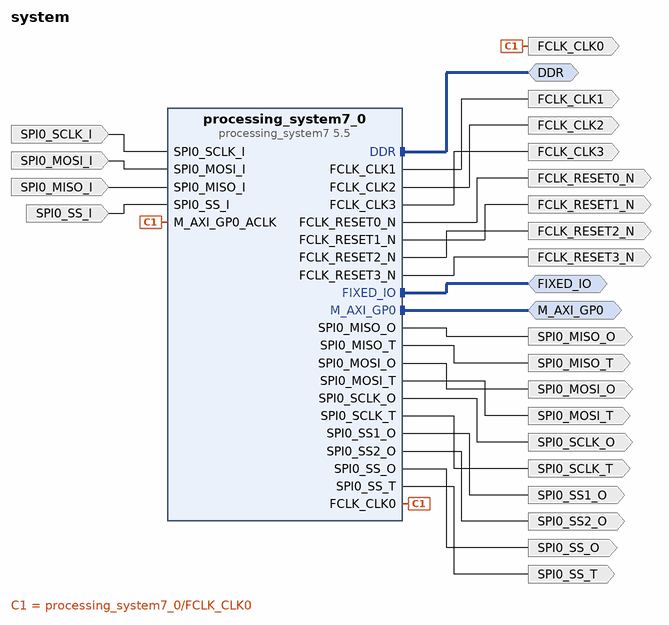
[diagram p0: block diagram of the top level]
# Vivado block design system, xc7z010clg400-1, Vivado 2016.4
create_bd_design system

create_bd_intf_port -mode Master -vlnv xilinx.com:interface:ddrx_rtl:1.0 DDR
create_bd_intf_port -mode Master -vlnv xilinx.com:display_processing_system7:fixedio_rtl:1.0 FIXED_IO
create_bd_intf_port -mode Master -vlnv xilinx.com:interface:aximm_rtl:1.0 M_AXI_GP0
set_property -dict {CONFIG.DATA_WIDTH 32 CONFIG.PROTOCOL AXI3 CONFIG.ADDR_WIDTH 32} [get_bd_intf_ports M_AXI_GP0]
create_bd_port -dir O -type clk FCLK_CLK0
set_property -dict {CONFIG.ASSOCIATED_BUSIF M_AXI_GP0} [get_bd_ports FCLK_CLK0]
create_bd_port -dir O -type clk FCLK_CLK1
create_bd_port -dir O -type clk FCLK_CLK2
create_bd_port -dir O -type clk FCLK_CLK3
create_bd_port -dir O -type rst FCLK_RESET0_N
create_bd_port -dir O -type rst FCLK_RESET1_N
create_bd_port -dir O -type rst FCLK_RESET2_N
create_bd_port -dir O -type rst FCLK_RESET3_N
create_bd_port -dir I SPI0_SCLK_I
create_bd_port -dir O SPI0_SCLK_O
create_bd_port -dir O SPI0_SCLK_T
create_bd_port -dir I SPI0_MOSI_I
create_bd_port -dir O SPI0_MOSI_O
create_bd_port -dir O SPI0_MOSI_T
create_bd_port -dir I SPI0_MISO_I
create_bd_port -dir O SPI0_MISO_O
create_bd_port -dir O SPI0_MISO_T
create_bd_port -dir I SPI0_SS_I
create_bd_port -dir O SPI0_SS_O
create_bd_port -dir O SPI0_SS1_O
create_bd_port -dir O SPI0_SS2_O
create_bd_port -dir O SPI0_SS_T

create_bd_cell -type ip -vlnv xilinx.com:ip:processing_system7:5.5 processing_system7_0

# ---- connections ----

connect_bd_intf_net [get_bd_intf_ports DDR] [get_bd_intf_pins processing_system7_0/DDR]
connect_bd_intf_net [get_bd_intf_ports FIXED_IO] [get_bd_intf_pins processing_system7_0/FIXED_IO]
connect_bd_intf_net [get_bd_intf_ports M_AXI_GP0] [get_bd_intf_pins processing_system7_0/M_AXI_GP0]
connect_bd_net [get_bd_pins processing_system7_0/FCLK_CLK0] [get_bd_ports FCLK_CLK0] [get_bd_pins processing_system7_0/M_AXI_GP0_ACLK]
connect_bd_net [get_bd_pins processing_system7_0/FCLK_CLK1] [get_bd_ports FCLK_CLK1]
connect_bd_net [get_bd_pins processing_system7_0/FCLK_CLK2] [get_bd_ports FCLK_CLK2]
connect_bd_net [get_bd_pins processing_system7_0/FCLK_CLK3] [get_bd_ports FCLK_CLK3]
connect_bd_net [get_bd_pins processing_system7_0/FCLK_RESET0_N] [get_bd_ports FCLK_RESET0_N]
connect_bd_net [get_bd_pins processing_system7_0/FCLK_RESET1_N] [get_bd_ports FCLK_RESET1_N]
connect_bd_net [get_bd_pins processing_system7_0/FCLK_RESET2_N] [get_bd_ports FCLK_RESET2_N]
connect_bd_net [get_bd_pins processing_system7_0/FCLK_RESET3_N] [get_bd_ports FCLK_RESET3_N]
connect_bd_net [get_bd_ports SPI0_SCLK_I] [get_bd_pins processing_system7_0/SPI0_SCLK_I]
connect_bd_net [get_bd_pins processing_system7_0/SPI0_SCLK_O] [get_bd_ports SPI0_SCLK_O]
connect_bd_net [get_bd_pins processing_system7_0/SPI0_SCLK_T] [get_bd_ports SPI0_SCLK_T]
connect_bd_net [get_bd_ports SPI0_MOSI_I] [get_bd_pins processing_system7_0/SPI0_MOSI_I]
connect_bd_net [get_bd_pins processing_system7_0/SPI0_MOSI_O] [get_bd_ports SPI0_MOSI_O]
connect_bd_net [get_bd_pins processing_system7_0/SPI0_MOSI_T] [get_bd_ports SPI0_MOSI_T]
connect_bd_net [get_bd_ports SPI0_MISO_I] [get_bd_pins processing_system7_0/SPI0_MISO_I]
connect_bd_net [get_bd_pins processing_system7_0/SPI0_MISO_O] [get_bd_ports SPI0_MISO_O]
connect_bd_net [get_bd_pins processing_system7_0/SPI0_MISO_T] [get_bd_ports SPI0_MISO_T]
connect_bd_net [get_bd_ports SPI0_SS_I] [get_bd_pins processing_system7_0/SPI0_SS_I]
connect_bd_net [get_bd_pins processing_system7_0/SPI0_SS_O] [get_bd_ports SPI0_SS_O]
connect_bd_net [get_bd_pins processing_system7_0/SPI0_SS1_O] [get_bd_ports SPI0_SS1_O]
connect_bd_net [get_bd_pins processing_system7_0/SPI0_SS2_O] [get_bd_ports SPI0_SS2_O]
connect_bd_net [get_bd_pins processing_system7_0/SPI0_SS_T] [get_bd_ports SPI0_SS_T]

# ---- address map ----
assign_bd_address -offset 0x40000000 -range 1G -target_address_space [get_bd_addr_spaces processing_system7_0/Data] [get_bd_addr_segs M_AXI_GP0/Reg]

validate_bd_design
save_bd_design
